# Altium schematic sheet SmartMeter.SchDoc: SMART METER _Main Board
size A3; SheetNumber: 3; ProjectName: Smart Meter
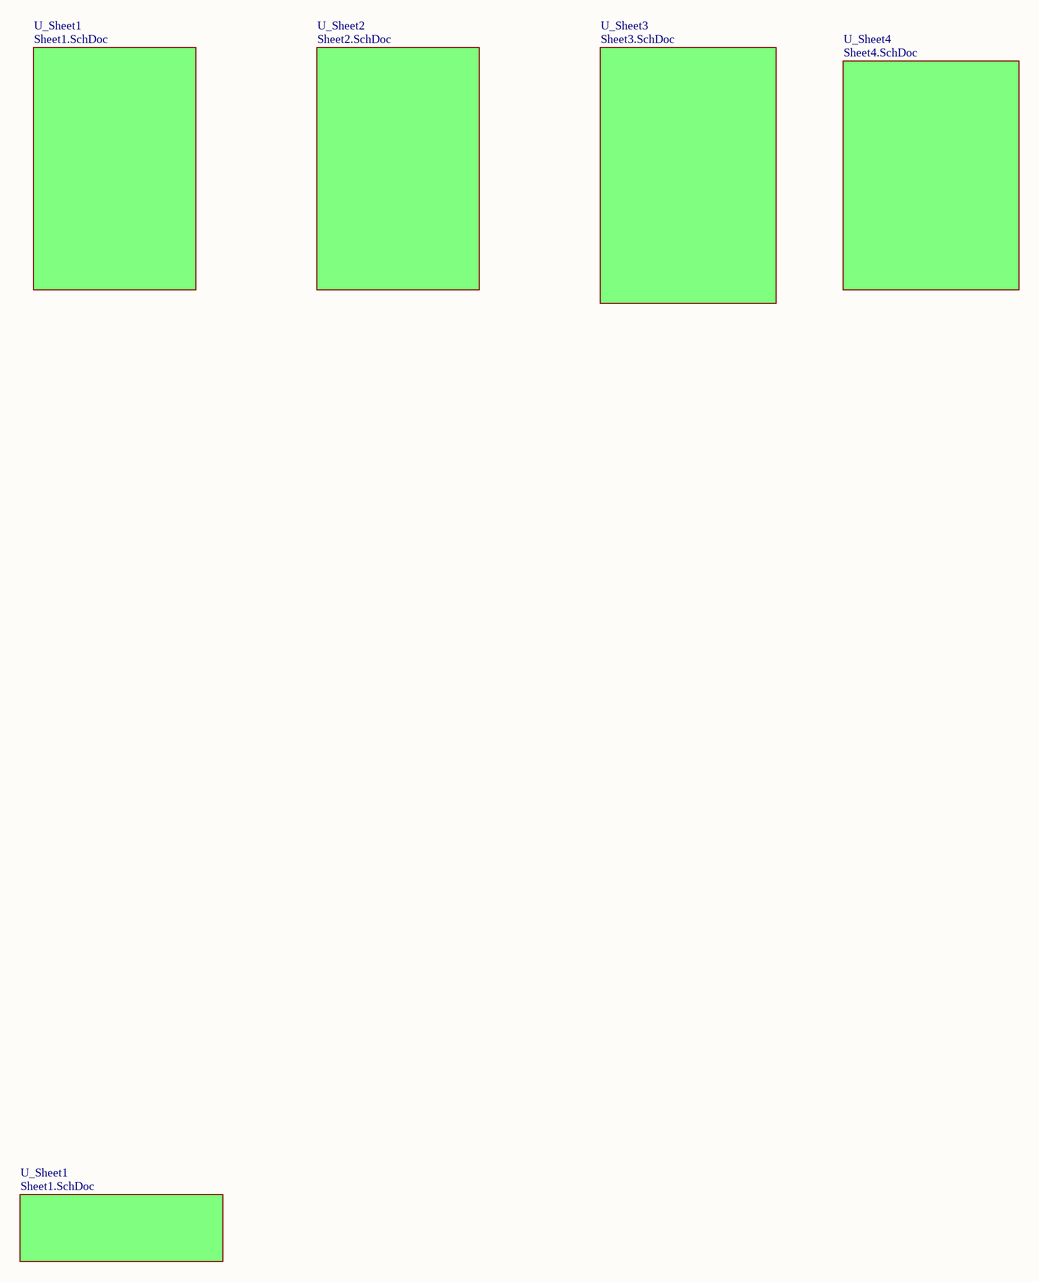
[diagram p0: SmartMeter.SchDoc]

## Sub-sheets
U_Sheet1 = Sheet1.SchDoc: no entries
U_Sheet1 = Sheet1.SchDoc: no entries
U_Sheet2 = Sheet2.SchDoc: no entries
U_Sheet3 = Sheet3.SchDoc: no entries
U_Sheet4 = Sheet4.SchDoc: no entries

## Notes on the sheet
- Title
- Size:
- Date:
- A3
- Number:
- Time:
- Revision:
- Sheet
- of
- File: